# Altium project MOSFET Switch Module (4-Channel).PrjPcb
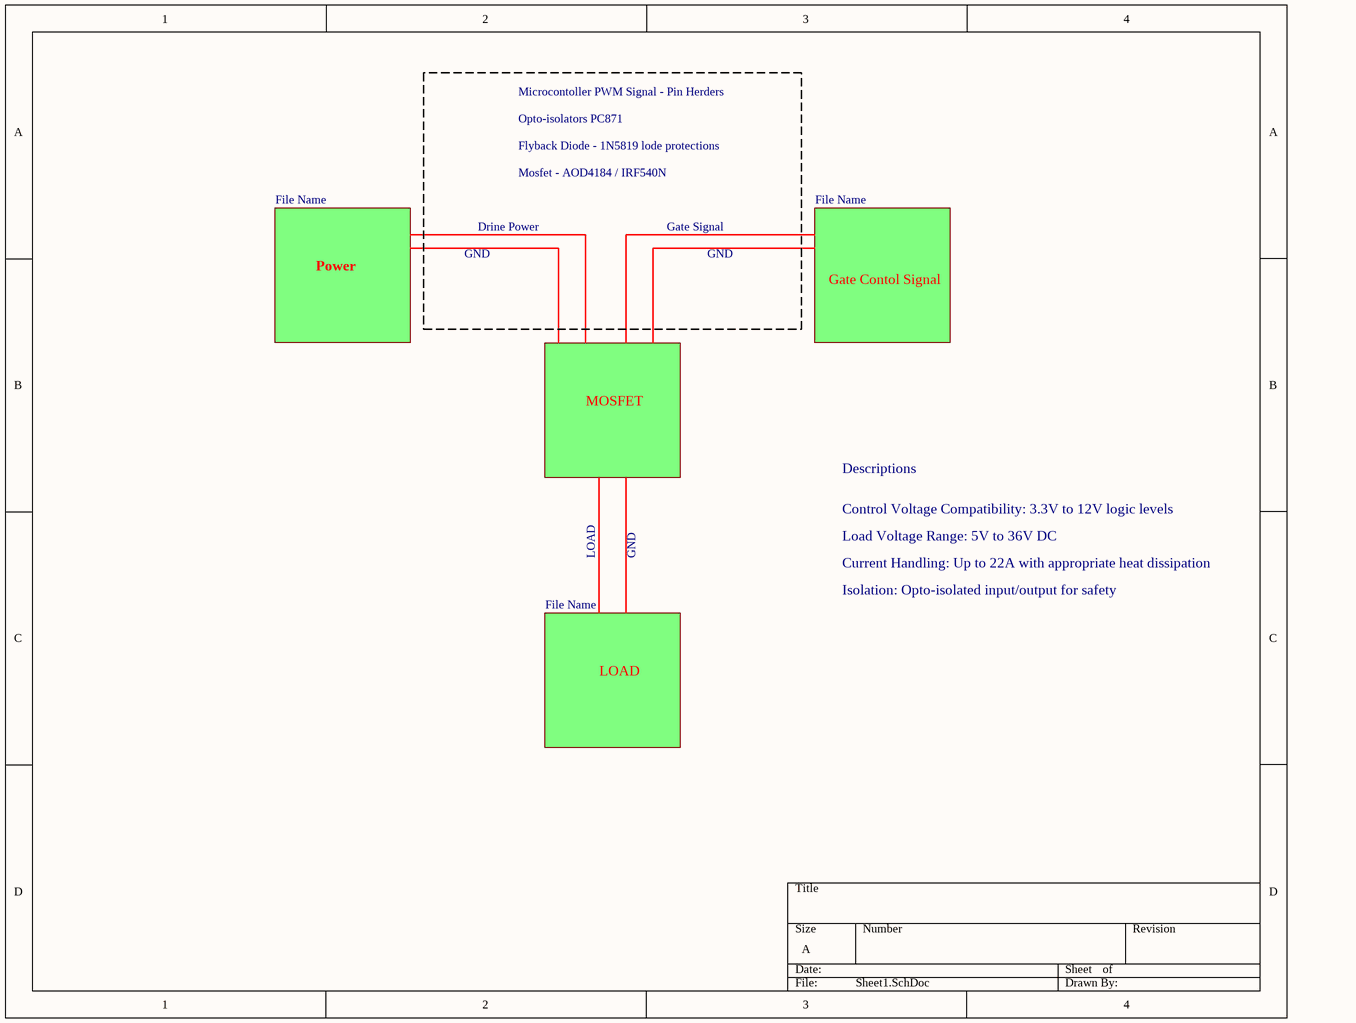
[diagram p0: Sheet1.SchDoc]
2 sheets, 50 parts. Net scope: global (net labels, ports and power ports of the same name join across sheets).
Board file: PCB1.PcbDoc
Sheets:
  Sheet1.SchDoc
  Sheet2.SchDoc

## Sheet Sheet1.SchDoc
size A; SheetNumber: 1; SheetTotal: 1

### Sub-sheets
Designator = File Name (file not in this document): no entries
Designator = File Name (file not in this document): no entries
Designator = File Name (file not in this document): no entries
Designator = File Name (file not in this document): no entries

### Notes on the sheet
- Microcontoller PWM Signal - Pin Herders
- Opto-isolators PC871
- Flyback Diode - 1N5819 lode protections
- Drine Power
- Mosfet - AOD4184 / IRF540N
- Gate Signal
- Power
- GND
- Gate Contol Signal
- MOSFET
- Descriptions
- LOAD
- Control Voltage Compatibility: 3.3V to 12V logic levels
- Load Voltage Range: 5V to 36V DC
- Current Handling: Up to 22A with appropriate heat dissipation
- Isolation: Opto-isolated input/output for safety

## Sheet Sheet2.SchDoc
size A3; SheetNumber: 2; SheetTotal: 2
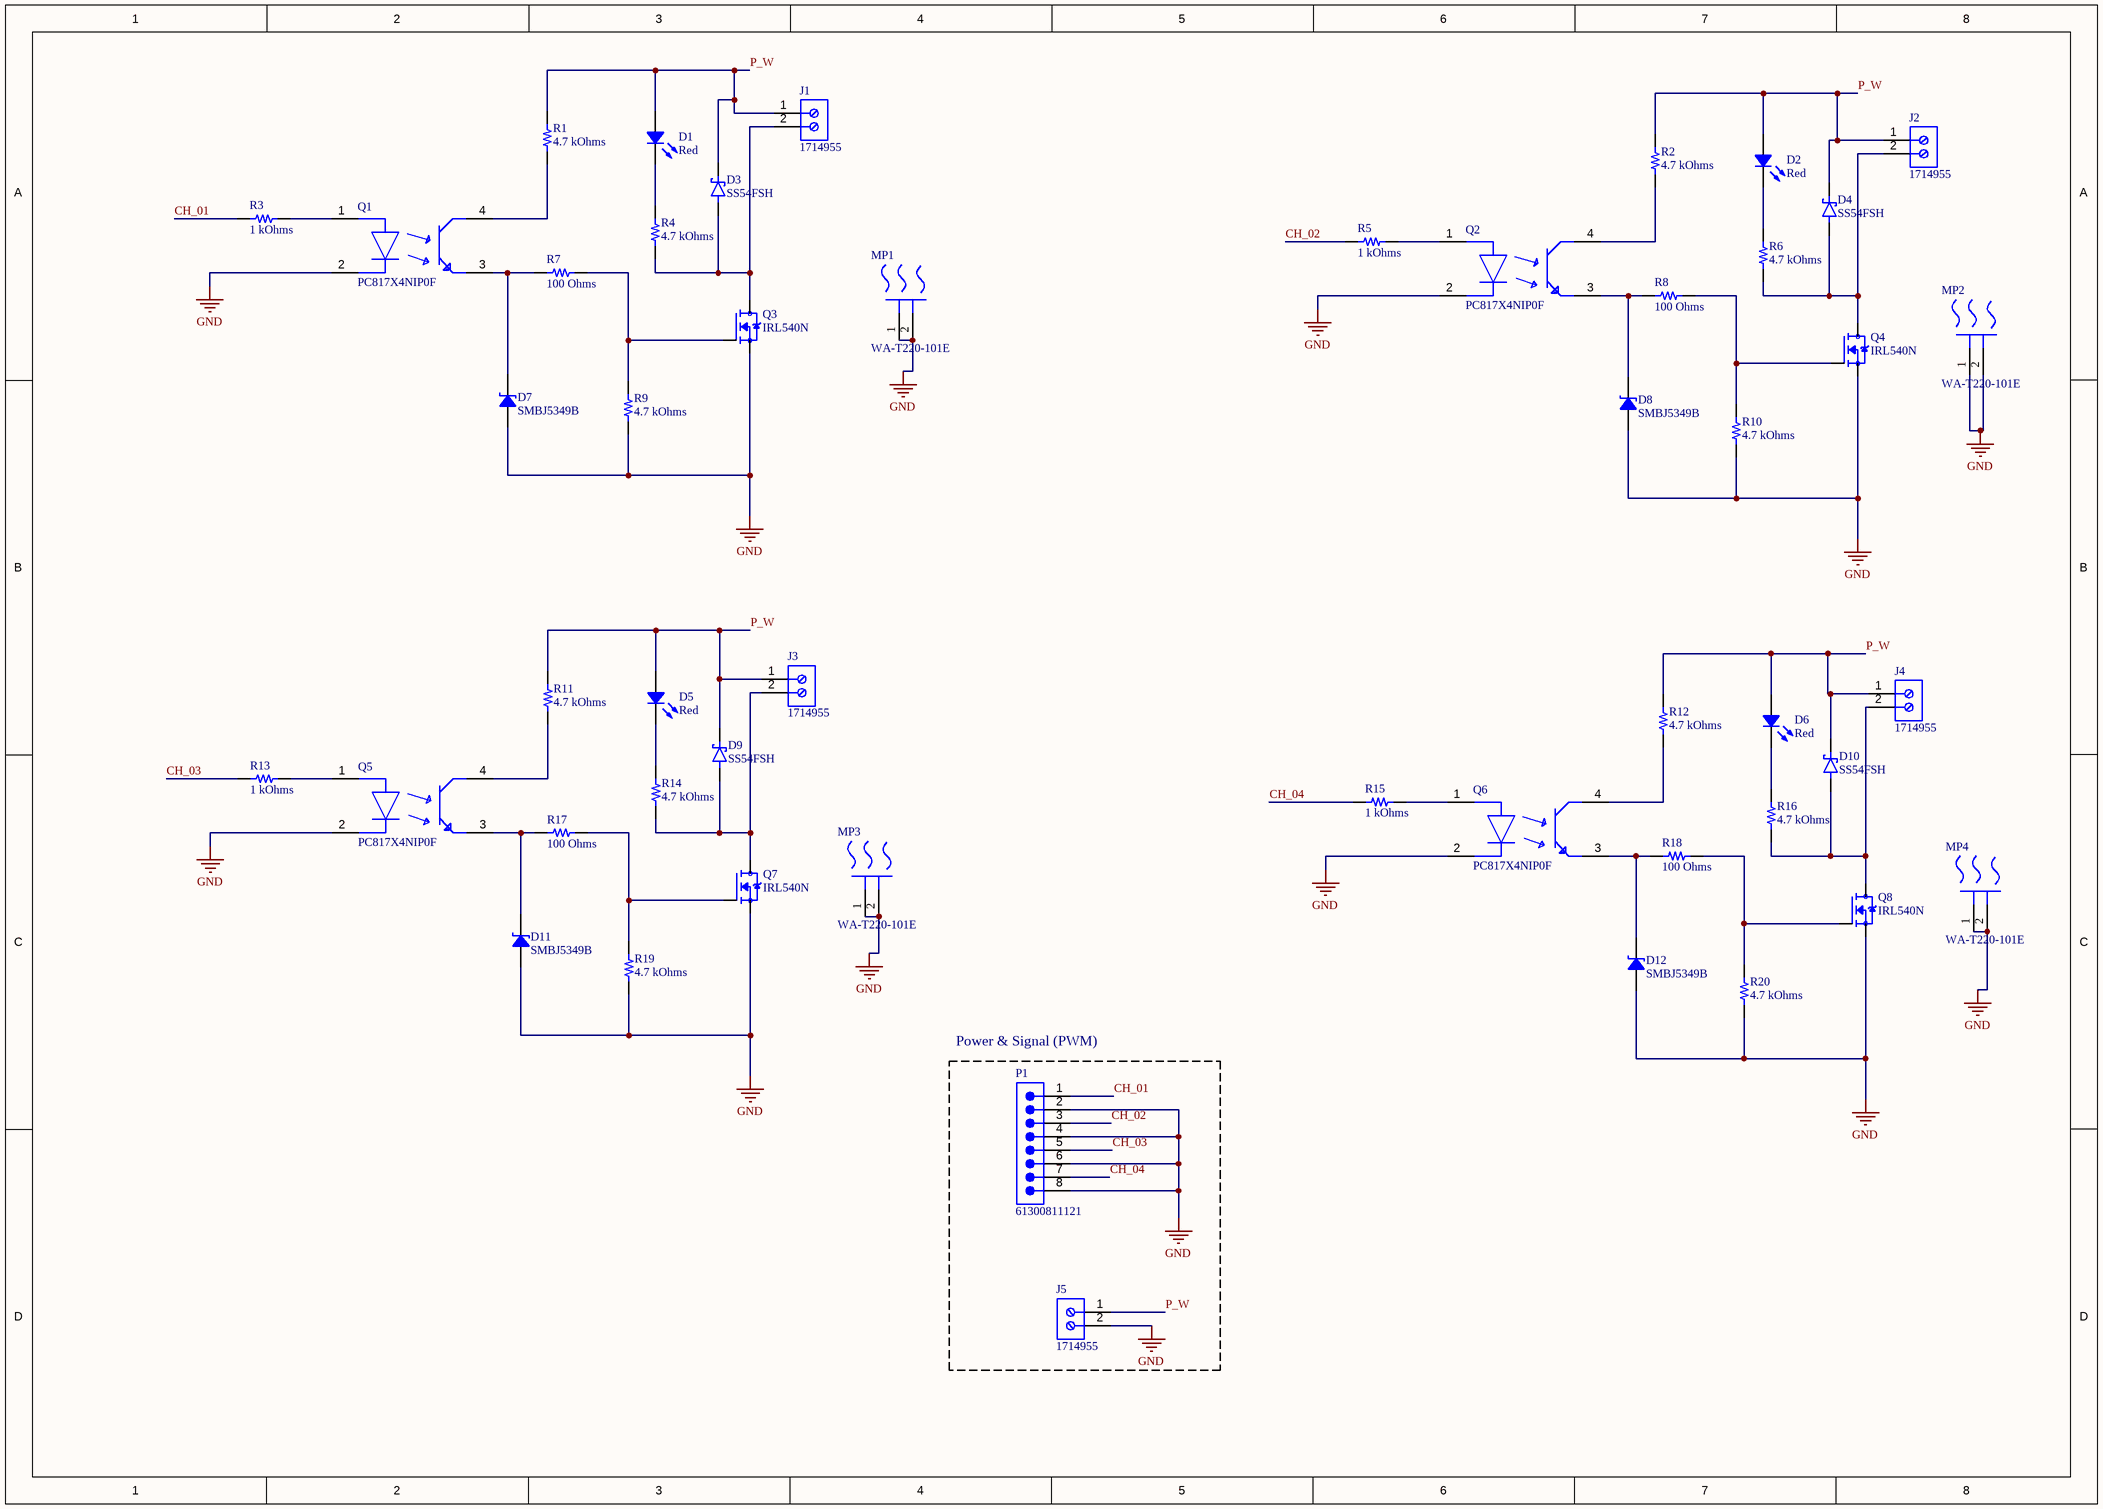
[diagram p1: Sheet2.SchDoc]

### Parts
D1  Red  [LED 0603_1608 RED]
D2  Red  [LED 0603_1608 RED]
D3  SS54FSH  [SODFL4725X110N]
D4  SS54FSH  [SODFL4725X110N]
D5  Red  [LED 0603_1608 RED]
D6  Red  [LED 0603_1608 RED]
D7  SMBJ5349B  [DO214AA SMB]
D8  SMBJ5349B  [DO214AA SMB]
D9  SS54FSH  [SODFL4725X110N]
D10  SS54FSH  [SODFL4725X110N]
D11  SMBJ5349B  [DO214AA SMB]
D12  SMBJ5349B  [DO214AA SMB]
J1  1714955  [PHOE-1714955_V]
J2  1714955  [PHOE-1714955_V]
J3  1714955  [PHOE-1714955_V]
J4  1714955  [PHOE-1714955_V]
J5  1714955  [PHOE-1714955_V]
MP1  WA-T220-101E  [FP-WA-T220-101E-MFG]
MP2  WA-T220-101E  [FP-WA-T220-101E-MFG]
MP3  WA-T220-101E  [FP-WA-T220-101E-MFG]
MP4  WA-T220-101E  [FP-WA-T220-101E-MFG]
P1  61300811121  [61300811121]
Q1  PC817X4NIP0F  [FP-PC817X4NIP0F-MFG]
Q2  PC817X4NIP0F  [FP-PC817X4NIP0F-MFG]
Q3  IRL540N  [TO254P1054X469X1930-3]
Q4  IRL540N  [TO254P1054X469X1930-3]
Q5  PC817X4NIP0F  [FP-PC817X4NIP0F-MFG]
Q6  PC817X4NIP0F  [FP-PC817X4NIP0F-MFG]
Q7  IRL540N  [TO254P1054X469X1930-3]
Q8  IRL540N  [TO254P1054X469X1930-3]
R1  4.7 kOhms  [RES 0603_1608]
R2  4.7 kOhms  [RES 0603_1608]
R3  1 kOhms  [RES 0603_1608]
R4  4.7 kOhms  [RES 0603_1608]
R5  1 kOhms  [RES 0603_1608]
R6  4.7 kOhms  [RES 0603_1608]
R7  100 Ohms  [RES 0603_1608]
R8  100 Ohms  [RES 0603_1608]
R9  4.7 kOhms  [RES 0603_1608]
R10  4.7 kOhms  [RES 0603_1608]
R11  4.7 kOhms  [RES 0603_1608]
R12  4.7 kOhms  [RES 0603_1608]
R13  1 kOhms  [RES 0603_1608]
R14  4.7 kOhms  [RES 0603_1608]
R15  1 kOhms  [RES 0603_1608]
R16  4.7 kOhms  [RES 0603_1608]
R17  100 Ohms  [RES 0603_1608]
R18  100 Ohms  [RES 0603_1608]
R19  4.7 kOhms  [RES 0603_1608]
R20  4.7 kOhms  [RES 0603_1608]

### Blocks framed on the sheet
Power & Signal (PWM): J5 P1

### Nets
GND: D7.1 D8.1 D11.1 D12.1 J5.2 MP1.1(MNT_1) MP1.2(MNT_2) MP2.1(MNT_1) MP2.2(MNT_2) MP3.1(MNT_1) MP3.2(MNT_2) MP4.1(MNT_1) MP4.2(MNT_2) P1.2 P1.4 P1.6 P1.8 Q1.2(C) Q2.2(C) Q3.3(S) Q4.3(S) Q5.2(C) Q6.2(C) Q7.3(S) Q8.3(S) R9.1 R10.1 R19.1 R20.1
CH_01: P1.1 R3.1
CH_02: P1.3 R5.1
CH_03: P1.5 R13.1
CH_04: P1.7 R15.1
P_W: D1.1 D2.1 D3.C(K) D4.C(K) D5.1 D6.1 D9.C(K) D10.C(K) J1.1 J2.1 J3.1 J4.1 J5.1 R1.2 R2.2 R11.2 R12.2
NetD1_2: D1.2 R4.2
NetD2_2: D2.2 R6.2
NetD3_A: D3.A J1.2 Q3.2(D) R4.1
NetD4_A: D4.A J2.2 Q4.2(D) R6.1
NetD5_2: D5.2 R14.2
NetD6_2: D6.2 R16.2
NetD7_2: D7.2 Q1.3(E) R7.1
NetD8_2: D8.2 Q2.3(E) R8.1
NetD9_A: D9.A J3.2 Q7.2(D) R14.1
NetD10_A: D10.A J4.2 Q8.2(D) R16.1
NetD11_2: D11.2 Q5.3(E) R17.1
NetD12_2: D12.2 Q6.3(E) R18.1
NetQ1_1: Q1.1(A) R3.2
NetQ1_4: Q1.4(C) R1.1
NetQ2_1: Q2.1(A) R5.2
NetQ2_4: Q2.4(C) R2.1
NetQ3_1: Q3.1(G) R7.2 R9.2
NetQ4_1: Q4.1(G) R8.2 R10.2
NetQ5_1: Q5.1(A) R13.2
NetQ5_4: Q5.4(C) R11.1
NetQ6_1: Q6.1(A) R15.2
NetQ6_4: Q6.4(C) R12.1
NetQ7_1: Q7.1(G) R17.2 R19.2
NetQ8_1: Q8.1(G) R18.2 R20.2

### Notes on the sheet
- DWG. NO.
- REV.
- SHT.
- REVISION
- DESCRIPTION
- DATE
- APPROVED
- THIS DOCUMENT AND THE DATA DISCLOSED HEREIN OR HEREWITH IS THE PROPERTY OF ALTIUM LIMITED AND MAY BE FREELY DISTRIBUTED IN WHOLE. NO RIGHTS ARE RESERVED OR EXPRESS OR IMPLIED WARANTEE GIVEN.
- ENG:
- DSN:
- APPROVALS
- PROJECT
- DOCUMENT REVISION:
- DESIGN ITEM:
- CHK:
- BOM:
- REFERENCE DOCUMENTS
- PROJECT REVISION:
- TITLE
- FAB DWG:
- PCB DWG:
- ASSY DWG:
- SCALE:
- SIZE
- C
- CAGE CODE
- FILE NAME
- DWG NO.
- SHEET
- OF
- REV

### Library data of the parts
D1 D2 D5 D6 = 5973005507F: LED RED 0603 SMD; Manufacturer: Dialight; Configuration: Standard; Current - Test: 20mA; Lens Color: 0.68mm; Lens Size: 1.20mm x 0.80mm; Lens Style: Rectangle with Flat Top; Millicandela Rating: 90mcd; Voltage - Forward (Vf) (Typ): 2V; Wavelength - Dominant: 630nm; Part Number: 5973005507F; Color: Red; ComponentLink1Description: Datasheet; ComponentLink1URL: http://www.dialightsignalsandcomponents.com/Assets/Drawings/2D_Drawings_DrawingDetailedSpec/NewDrawings/18369A.pdf; ComponentLink2Description: DigiKey Link; ComponentLink2URL: https://www.digikey.com/en/products/detail/dialight/5973005507F/9385429; Device Package: 0603 (1608 Metric); Height (Max): 0.68mm; LastUpdated: 6/3/2024 7:59:48 PM; Lifecycle Status: Active; Minimum Order: 1; Mounting Type: Surface Mount; Package / Case: 0603 (1608 Metric); Packaging: TapeAndReel; PartId: 378; Part Status: Active; Price: 0.08; Series: 597; Size / Dimension: 1.60mm L x 0.80mm W; Supplier 1: DigiKey; Supplier Part Number 1: 350-4374-1-ND; Supplier Device Package: 0603; Value: Red
D3 D4 D9 D10 = SS54FSH: 5A, 40V, Schottky Rectifier; MF: Taiwan Semiconductor; Value: *; SnapEDA_Link: https://www.snapeda.com/parts/SS54FSH/Taiwan+Semiconductor/view-part/?ref=snap; MP: SS54FSH; Check_prices: https://www.snapeda.com/parts/SS54FSH/Taiwan+Semiconductor/view-part/?ref=eda; Availability: In Stock; Price: None; Package: SOD-128-2 Taiwan Semiconductor
D7 D8 D11 D12 = SMBJ5349B-TP: DIODE ZENER 12V 5W DO214AA; Manufacturer: Micro Commercial Co; Current - Reverse Leakage @ Vr: 2 µA @ 9.1 V; Impedance (Max) (Zzt): 2.5 Ohms; Tolerance: ±5%; Voltage - Forward (Vf) (Max) @ If: 1.2 V @ 1 mA; Part Number: SMBJ5349B-TP; ComponentLink1Description: Datasheet; ComponentLink1URL: https://www.mccsemi.com/pdf/Products/SMBJ5338B-SMBJ5388B(SMB).pdf; ComponentLink2Description: DigiKey Link; ComponentLink2URL: https://www.digikey.com/en/products/detail/micro-commercial-co/SMBJ5349B-TP/1636171; LastUpdated: 6/3/2024 7:55:14 PM; Lifecycle Status: Active; Minimum Order: 1; Mounting Type: Surface Mount; Operating Temperature: -55°C ~ 150°C; Package / Case: DO-214AA, SMB; Packaging: TapeAndReel; PartId: 1041; Part Status: Active; Power - Max: 5 W; Price: 0.10; Series: -; Supplier 1: DigiKey; Supplier Part Number 1: SMBJ5349B-TPMSCT-ND; Supplier Device Package: DO-214AA (SMB); Voltage - Zener (Nom) (Vz): 12 V
J1-J5 = CMP-2000-05797-1: PC Terminal Block, Pitch 6.35 mm, 1 x 2 Position, Height 21.5 mm, Tail Lenght 5.1 mm, RoHS, Bulk; Manufacturer: Phoenix Contact; Package Description: PC Terminal Block, Pitch 6.35 mm, 1 x 2 Position, Height 21.5 mm, Tail Lenght 5.1 mm; Datasheet URL: http://media.digikey.com/pdf/Data%20Sheets/Phoenix%20Contact%20PDFs/1714955.pdf; Package Reference: 1714955; Manufacturer URL: http://www.phoenixcontact.com/; Datasheet Version: 02/2010; Mounting Technology: ThroughHole
MP1-MP4 = CMP-33535-000033-1: HEATSINK AND CLIP FOR TO-220 BLK; Natural Thermal Resistance: 12°C/W; Finish: Anodized; Shape: Fins; RoHS Compliant: Yes; Mount: Clip; Width: 0.72inch; Packaging: Bulk; Weight: 0.35oz; Case/Package: TO-220; Series: W; Height: 30.5mm; Height Off Base: 0.63inch; Material: Aluminium; Length: 1.201inch; Type: Passive; Package Cooled: TO-220; Package Quantity: 1; Color: Black
P1 = CMP-1502-01076-3: NexarPartId: 32855533; Connector Type: Male Pin; Number of Contacts: 8; Voltage Rating: 250V; Current Rating: 3A; Contact Resistance: 20mΩ; Pitch: 2.54mm; Gender: Male; Termination: Solder; Contact Material: Copper; Mount: Through Hole; Lead Pitch: 2.54mm; Number of Positions: 8; Operating Supply Voltage: 250V; Number of Pins: 8; Max Operating Temperature: 105°C; Height: 8.54mm; REACH SVHC: Unknown; Number of Rows: 1; Packaging: Bulk; Contact Plating: Gold; Contact Mating Length: 5.9944mm; Orientation: Vertical; RoHS: Compliant; Color: Black; Min Operating Temperature: -40°C
Q1 Q2 Q5 Q6 = CMP-65434-000001-1: OPTOISOLATOR 5KV TRANS 4SMD; Manufacturer: Sharp; Collector Emitter Voltage: 80V; Standoff Height: 0.1mm; Power Dissipation: 200mW; Min Current Transfer Ratio: 50%; Reverse Voltage: 6V; Forward Current: 20mA; Forward Voltage: 1.2V; Max Current Transfer Ratio: 600%; Isolation Voltage: 5kVrms; Mouser Description: Transistor Output Optocouplers Photocoupler 300-600% CRT; RoHS: TRUE; ComponentLink2URL: https://www.sharpsde.com/fileadmin/products/Optoelectronics/Isolation%20Devices/Specs%20Photocoupler/PC817XxNIP0F_17Jun08_Spec_ED-04P129A.pdf; Lead Free: Yes; Device Class L1: Optoelectronics; ComponentLink2Description: Datasheet; Device Class L2: Optocouplers; Temperature: -30°C to +100°C; Temperature Range Low: -30°C; Automotive: No; Temperature Range High: +100°C; Octopart: https://octopart.com/pc817x4nip0f-sharp-20650453; Height: 4.6mm; Digikey Description: OPTOISOLATOR 5KV TRANS 4SMD; Category: Trans; Device Class L3: unset; Package: PC817X4NIP0F; Manufacturer Part Number: PC817X4NIP0F; Emiiter Collector Voltage: 6V
Q3 Q4 Q7 Q8 = IRF540NPBF: RoHS Compliant | Low RDS(on) | Industry-leading quality | Dynamic dv/dt Rating | Fast Switching | Fully Avalanche Rated | 175C Operating Temperature; MF: Infineon; SnapEDA_Link: https://www.snapeda.com/parts/IRF540NPBF/Infineon+Technologies/view-part/?ref=snap; Availability: In Stock; MP: IRF540NPBF; Purchase-URL: https://pricing.snapeda.com/search/part/IRF540NPBF/?ref=eda; Price: None; Value: *; Check_prices: https://www.snapeda.com/parts/IRF540NPBF/Infineon+Technologies/view-part/?ref=eda; Package: TO-220 Infineon
R1 R2 R4 R6 R9-R12 R14 R16 R19 R20 = ERA-3AEB472V: RES SMD 4.7K OHM 0.1% 1/10W 0603; Manufacturer: Panasonic Electronic Components; Power (Watts): 0.1W, 1/10W; Temperature Coefficient: ±25ppm/°C; Part Number: ERA-3AEB472V; Value: 4.7 kOhms; ComponentLink1Description: Datasheet; ComponentLink1URL: https://industrial.panasonic.com/cdbs/www-data/pdf/RDM0000/AOA0000C307.pdf; ComponentLink2Description: DigiKey Link; ComponentLink2URL: https://www.digikey.com/en/products/detail/panasonic-electronic-components/ERA-3AEB472V/1465870; Composition: Thin Film; Device Package: 0603 (1608 Metric); Features: Automotive AEC-Q200; Height - Seated (Max): 0.022" (0.55mm); LastUpdated: 2/9/2024 8:43:34 PM; Lifecycle Status: Active; Minimum Order: 1; Number of Terminations: 2; Operating Temperature: -55°C ~ 155°C; Package / Case: 0603 (1608 Metric); Packaging: TapeAndReel; PartId: 5519; Part Status: Active; Price: 0.03; Ratings: AEC-Q200; Resistance: 4.7 kOhms; Series: ERA-3A; Size / Dimension: 0.063" L x 0.031" W (1.60mm x 0.80mm); Supplier 1: DigiKey; Supplier Part Number 1: P4.7KDBCT-ND; Supplier Device Package: 0603; Tolerance: ±0.1%
R3 R5 R13 R15 = CPF0603B1K0E: RES SMD 1K OHM 0.1% 1/16W 0603; Manufacturer: TE Connectivity Passive Product; Power (Watts): 0.063W, 1/16W; Temperature Coefficient: ±25ppm/°C; Part Number: CPF0603B1K0E; Value: 1 kOhms; ComponentLink1Description: Datasheet; ComponentLink1URL: https://www.te.com/commerce/DocumentDelivery/DDEController?Action=srchrtrv&DocNm=1773200&DocType=DS&DocLang=English; ComponentLink2Description: DigiKey Link; ComponentLink2URL: https://www.digikey.com/en/products/detail/te-connectivity-passive-product/CPF0603B1K0E/2390473; Composition: Thin Film; Device Package: 0603 (1608 Metric); Height - Seated (Max): 0.022" (0.55mm); LastUpdated: 2/9/2024 8:43:37 PM; Lifecycle Status: Active; Minimum Order: 1; Number of Terminations: 2; Operating Temperature: -55°C ~ 155°C; Package / Case: 0603 (1608 Metric); Packaging: TapeAndReel; PartId: 4877; Part Status: Active; Price: 0.09; Resistance: 1 kOhms; Series: CPF, Neohm; Size / Dimension: 0.061" L x 0.031" W (1.55mm x 0.80mm); Supplier 1: DigiKey; Supplier Part Number 1: A119887CT-ND; Supplier Device Package: 0603; Tolerance: ±0.1%
R7 R8 R17 R18 = RNCS0603BKE100R: RES 100 OHM 0.1% 1/16W 0603; Manufacturer: Stackpole Electronics Inc; Power (Watts): 0.063W, 1/16W; Temperature Coefficient: ±25ppm/°C; Part Number: RNCS0603BKE100R; Value: 100 Ohms; ComponentLink1Description: Datasheet; ComponentLink1URL: https://www.seielect.com/catalog/sei-rncs_rnch.pdf; ComponentLink2Description: DigiKey Link; ComponentLink2URL: https://www.digikey.com/en/products/detail/stackpole-electronics-inc/RNCS0603BKE100R/1799988; Composition: Thin Film; Device Package: 0603 (1608 Metric); Features: Anti-Corrosive, Automotive AEC-Q200, Moisture Resistant; Height - Seated (Max): 0.022" (0.55mm); LastUpdated: 2/9/2024 8:43:37 PM; Lifecycle Status: Active; Minimum Order: 1; Number of Terminations: 2; Operating Temperature: -55°C ~ 155°C; Package / Case: 0603 (1608 Metric); Packaging: TapeAndReel; PartId: 4839; Part Status: Active; Price: 0.06; Ratings: AEC-Q200; Resistance: 100 Ohms; Series: RNCS; Size / Dimension: 0.061" L x 0.031" W (1.55mm x 0.80mm); Supplier 1: DigiKey; Supplier Part Number 1: RNCS0603BKE100RCT-ND; Supplier Device Package: 0603; Tolerance: ±0.1%